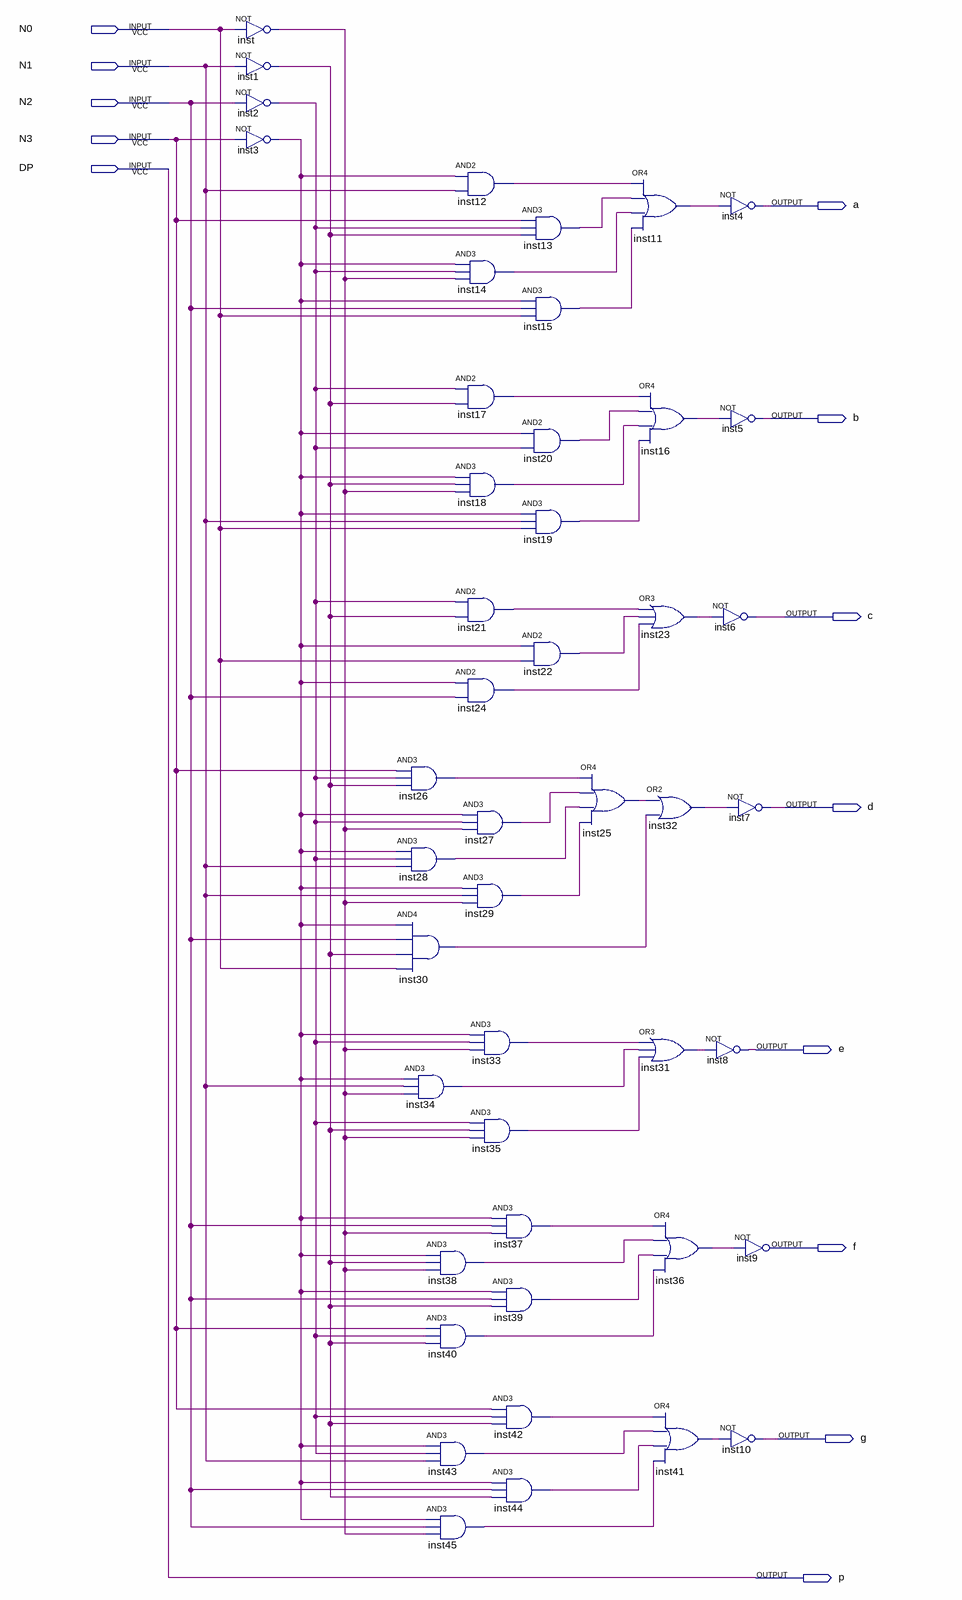
[diagram p0: schematic sheet]
// Quartus schematic disp7seg.bdf as structural Verilog: 46 symbols, 13 pins
module disp7seg (
  input  N0,
  input  N1,
  input  N2,
  input  N3,
  input  DP,
  output a,
  output b,
  output c,
  output d,
  output e,
  output f,
  output g,
  output p
);

  wire inst1_out, inst2_out, inst3_out, inst11_out, inst12_out, inst13_out, inst14_out, inst15_out,
       inst16_out, inst17_out, inst18_out, inst19_out, inst20_out, inst21_out, inst22_out, inst23_out,
       inst24_out, inst25_out, inst26_out, inst27_out, inst28_out, inst29_out, inst30_out, inst31_out,
       inst32_out, inst33_out, inst34_out, inst35_out, inst36_out, inst37_out, inst38_out, inst39_out,
       inst40_out, inst41_out, inst42_out, inst43_out, inst44_out, inst45_out, inst_out;

  not inst (inst_out, N0);
  not inst1 (inst1_out, N1);
  not inst2 (inst2_out, N2);
  not inst3 (inst3_out, N3);
  and inst26 (inst26_out, N3, inst2_out, inst1_out);
  and inst28 (inst28_out, inst3_out, inst2_out, N1);
  and inst30 (inst30_out, inst3_out, N2, inst1_out, N0);
  and inst34 (inst34_out, inst3_out, N1, inst_out);
  and inst12 (inst12_out, inst3_out, N1);
  and inst14 (inst14_out, inst3_out, inst2_out, inst_out);
  and inst17 (inst17_out, inst2_out, inst1_out);
  and inst18 (inst18_out, inst3_out, inst1_out, inst_out);
  and inst21 (inst21_out, inst2_out, inst1_out);
  and inst24 (inst24_out, inst3_out, N2);
  and inst27 (inst27_out, inst3_out, inst2_out, inst_out);
  and inst29 (inst29_out, inst3_out, N1, inst_out);
  and inst33 (inst33_out, inst3_out, inst2_out, inst_out);
  and inst35 (inst35_out, inst2_out, inst1_out, inst_out);
  and inst38 (inst38_out, inst3_out, inst1_out, inst_out);
  and inst40 (inst40_out, N3, inst2_out, inst1_out);
  and inst43 (inst43_out, inst3_out, inst2_out, N1);
  and inst45 (inst45_out, inst3_out, N2, inst_out);
  and inst13 (inst13_out, N3, inst2_out, inst1_out);
  and inst15 (inst15_out, inst3_out, N2, N0);
  and inst20 (inst20_out, inst3_out, inst2_out);
  and inst19 (inst19_out, inst3_out, N1, N0);
  and inst22 (inst22_out, inst3_out, N0);
  and inst37 (inst37_out, inst3_out, N2, inst_out);
  and inst39 (inst39_out, inst3_out, N2, inst1_out);
  and inst42 (inst42_out, N3, inst2_out, inst1_out);
  and inst44 (inst44_out, inst3_out, N2, inst1_out);
  or inst25 (inst25_out, inst26_out, inst27_out, inst28_out, inst29_out);
  or inst11 (inst11_out, inst12_out, inst13_out, inst14_out, inst15_out);
  or inst16 (inst16_out, inst17_out, inst20_out, inst18_out, inst19_out);
  or inst23 (inst23_out, inst21_out, inst22_out, inst24_out);
  or inst32 (inst32_out, inst25_out, inst30_out);
  or inst31 (inst31_out, inst33_out, inst34_out, inst35_out);
  or inst36 (inst36_out, inst37_out, inst38_out, inst39_out, inst40_out);
  or inst41 (inst41_out, inst42_out, inst43_out, inst44_out, inst45_out);
  not inst6 (c, inst23_out);
  not inst8 (e, inst31_out);
  not inst4 (a, inst11_out);
  not inst5 (b, inst16_out);
  not inst7 (d, inst32_out);
  not inst9 (f, inst36_out);
  not inst10 (g, inst41_out);

  assign p = DP;
endmodule
